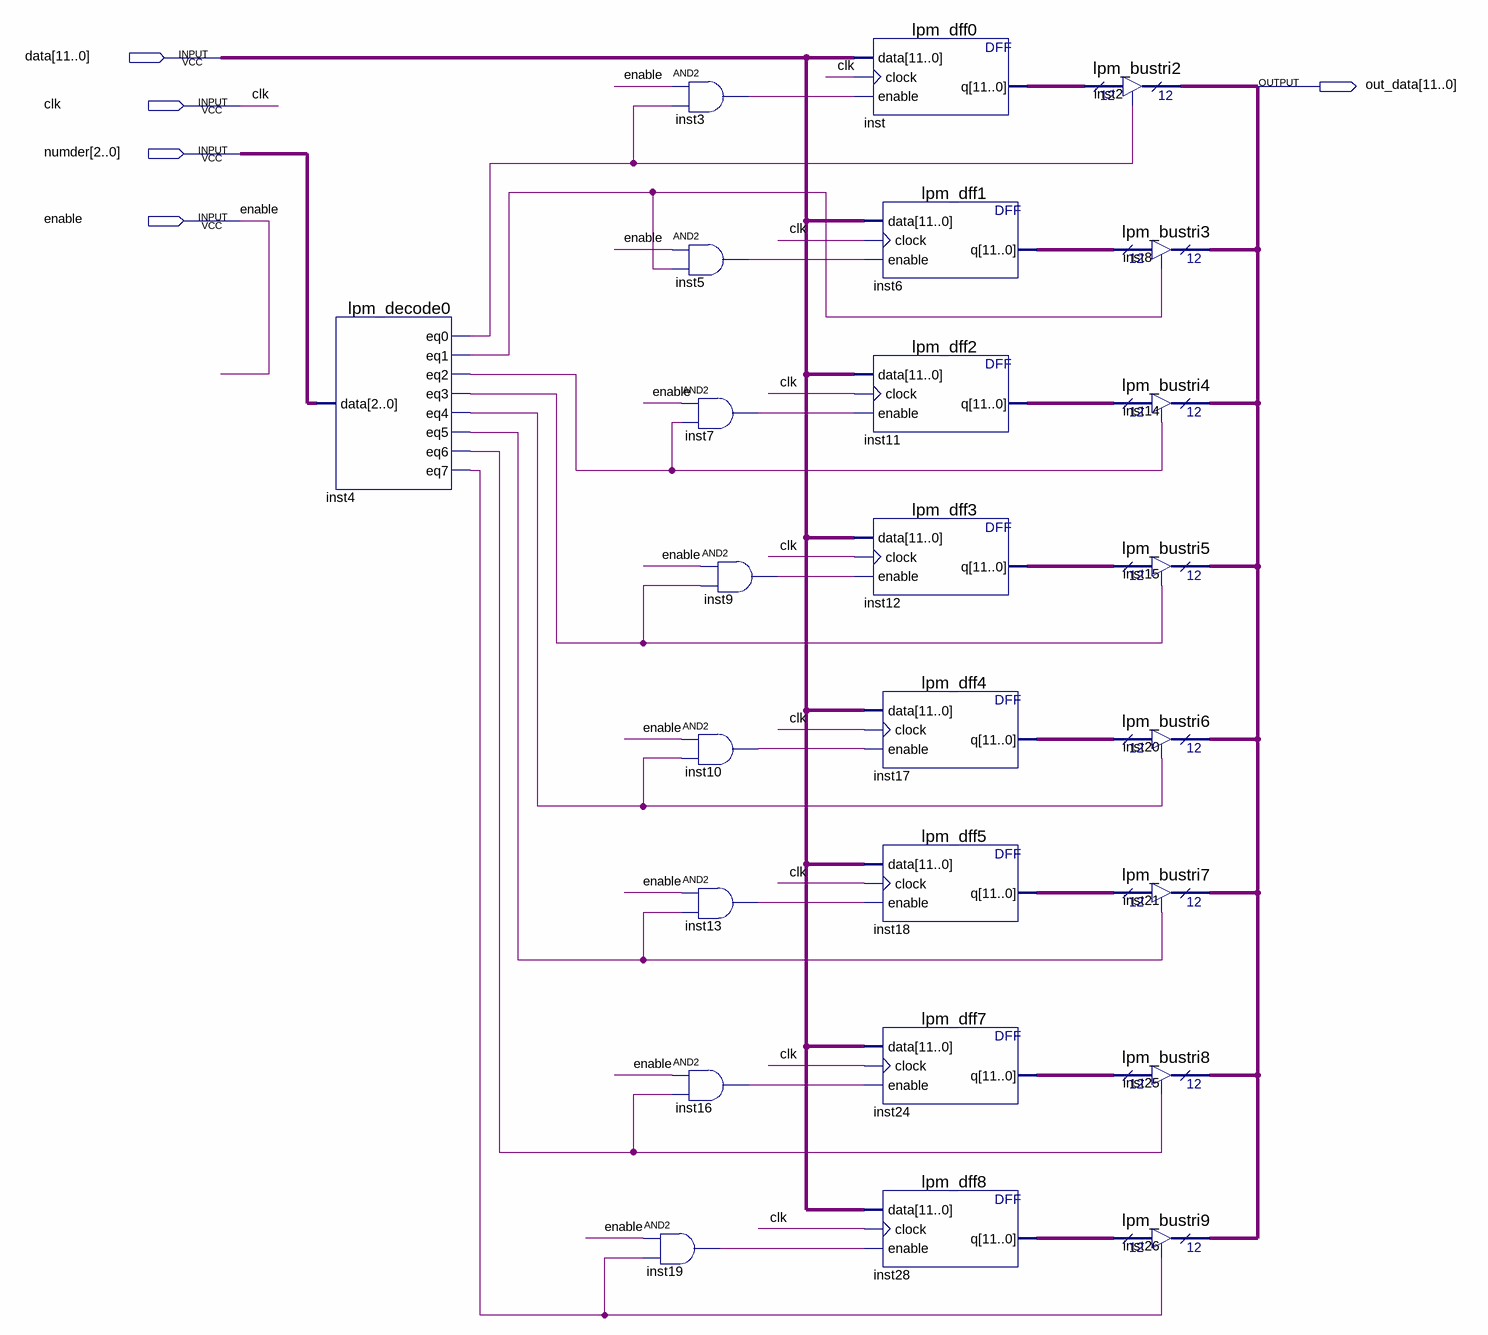
[diagram p0: schematic sheet]
// Quartus schematic POH.bdf as structural Verilog: 25 symbols, 5 pins
module POH (
  input  [11:0] data,
  input  clk,
  input  [2:0] numder,
  input  enable,
  output [11:0] out_data
);

  wire inst3_out, inst4_eq0, inst4_eq1, inst4_eq2, inst4_eq3, inst4_eq4, inst4_eq5, inst4_eq6, inst4_eq7,
       inst5_out, inst7_out, inst9_out, inst10_out, inst13_out, inst16_out, inst19_out;
  wire [11:0] inst6_q, inst11_q, inst12_q, inst17_q, inst18_q, inst24_q, inst28_q, inst_q;

  lpm_decode0 inst4 (
    .data(numder), .eq0(inst4_eq0), .eq1(inst4_eq1), .eq2(inst4_eq2), .eq3(inst4_eq3), .eq4(inst4_eq4),
    .eq5(inst4_eq5), .eq6(inst4_eq6), .eq7(inst4_eq7));
  and inst3 (inst3_out, enable, inst4_eq0);
  and inst5 (inst5_out, enable, inst4_eq1);
  and inst7 (inst7_out, enable, inst4_eq2);
  and inst10 (inst10_out, enable, inst4_eq4);
  and inst13 (inst13_out, enable, inst4_eq5);
  and inst16 (inst16_out, enable, inst4_eq6);
  and inst19 (inst19_out, enable, inst4_eq7);
  and inst9 (inst9_out, enable, inst4_eq3);
  lpm_dff0 inst (.data(data), .clock(clk), .enable(inst3_out), .q(inst_q));
  lpm_dff1 inst6 (.data(data), .clock(clk), .enable(inst5_out), .q(inst6_q));
  lpm_dff2 inst11 (.data(data), .clock(clk), .enable(inst7_out), .q(inst11_q));
  lpm_dff3 inst12 (.data(data), .clock(clk), .enable(inst9_out), .q(inst12_q));
  lpm_dff4 inst17 (.data(data), .clock(clk), .enable(inst10_out), .q(inst17_q));
  lpm_dff5 inst18 (.data(data), .clock(clk), .enable(inst13_out), .q(inst18_q));
  lpm_dff7 inst24 (.data(data), .clock(clk), .enable(inst16_out), .q(inst24_q));
  lpm_dff8 inst28 (.data(data), .clock(clk), .enable(inst19_out), .q(inst28_q));
  lpm_bustri2 inst2 (.enabledt(inst4_eq0), .data(inst_q), .tridata(out_data));
  lpm_bustri3 inst8 (.enabledt(inst4_eq1), .data(inst6_q), .tridata(out_data));
  lpm_bustri4 inst14 (.enabledt(inst4_eq2), .data(inst11_q), .tridata(out_data));
  lpm_bustri5 inst15 (.enabledt(inst4_eq3), .data(inst12_q), .tridata(out_data));
  lpm_bustri6 inst20 (.enabledt(inst4_eq4), .data(inst17_q), .tridata(out_data));
  lpm_bustri7 inst21 (.enabledt(inst4_eq5), .data(inst18_q), .tridata(out_data));
  lpm_bustri8 inst25 (.enabledt(inst4_eq6), .data(inst24_q), .tridata(out_data));
  lpm_bustri9 inst26 (.enabledt(inst4_eq7), .data(inst28_q), .tridata(out_data));
endmodule
